# Altium schematic sheet TENG.SchDoc
size A4; SheetNumber: 3; SheetTotal: 5
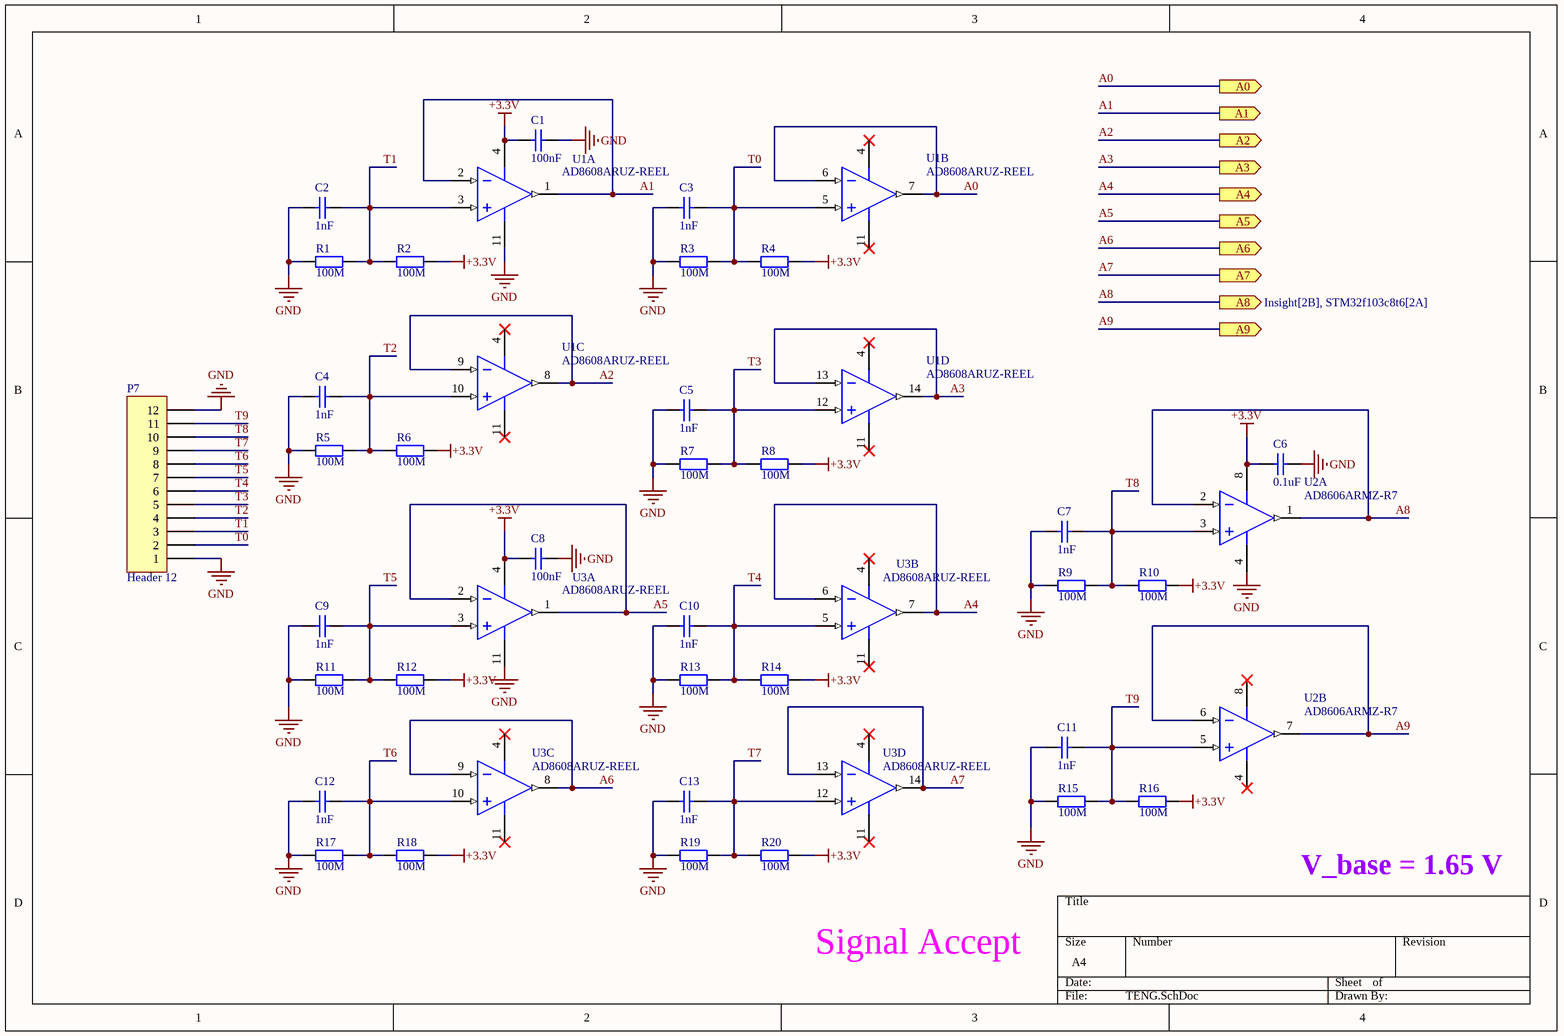
[diagram p0: TENG.SchDoc]

## Parts
C1  100nF  [0402_C]
C2  1nF  [0402_C]
C3  1nF  [0402_C]
C4  1nF  [0402_C]
C5  1nF  [0402_C]
C6  0.1uF  [0402_C]
C7  1nF  [0402_C]
C8  100nF  [0402_C]
C9  1nF  [0402_C]
C10  1nF  [0402_C]
C11  1nF  [0402_C]
C12  1nF  [0402_C]
C13  1nF  [0402_C]
P7  Header 12  [HDR1X12]
R1  100M  [0402_R]
R2  100M  [0402_R]
R3  100M  [0402_R]
R4  100M  [0402_R]
R5  100M  [0402_R]
R6  100M  [0402_R]
R7  100M  [0402_R]
R8  100M  [0402_R]
R9  100M  [0402_R]
R10  100M  [0402_R]
R11  100M  [0402_R]
R12  100M  [0402_R]
R13  100M  [0402_R]
R14  100M  [0402_R]
R15  100M  [0402_R]
R16  100M  [0402_R]
R17  100M  [0402_R]
R18  100M  [0402_R]
R19  100M  [0402_R]
R20  100M  [0402_R]
U1  AD8608ARUZ-REEL  [ADI-RU-14_N]  (parts A,B,C,D of 4)
U2  AD8606ARMZ-R7  [ADI-RM-8_N]  (parts A,B of 2)
U3  AD8608ARUZ-REEL  [ADI-RU-14_N]  (parts A,B,C,D of 4)

## Ports
A0 (out, see Insight[2A], STM32f103c8t6[1A]), A1 (out, see Insight[2B], STM32f103c8t6[1A]), A2 (out, see Insight[2B], STM32f103c8t6[1A]), A3 (out, see Insight[2B], STM32f103c8t6[1A]), A4 (out, see Insight[2B], STM32f103c8t6[1A]), A5 (out, see Insight[2B], STM32f103c8t6[1A]), A6 (out, see Insight[2B], STM32f103c8t6[1A]), A7 (out, see Insight[2B], STM32f103c8t6[1A]), A8 (out, see Insight[2B], STM32f103c8t6[2A]), A9 (out, see Insight[2B], STM32f103c8t6[2A])

## Nets
+3.3V: C1.2 C6.2 C8.2 R2.1 R4.1 R6.1 R8.1 R10.1 R12.1 R14.1 R16.1 R18.1 R20.1 U1.4(+V) U2.8(+V) U3.4(+V)
GND: C1.1 C2.2 C3.2 C4.2 C5.2 C6.1 C7.2 C8.1 C9.2 C10.2 C11.2 C12.2 C13.2 P7.1 P7.12 R1.2 R3.2 R5.2 R7.2 R9.2 R11.2 R13.2 R15.2 R17.2 R19.2 U1.11(-V) U2.4(-V) U3.11(-V)
A0: U1.6(-IN_B) U1.7(OUT_B) ; port A0
A1: U1.1(OUT_A) U1.2(-IN_A) ; port A1
A2: U1.8(OUT_C) U1.9(-IN_C) ; port A2
A3: U1.13(-IN_D) U1.14(OUT_D) ; port A3
A4: U3.6(-IN_B) U3.7(OUT_B) ; port A4
A5: U3.1(OUT_A) U3.2(-IN_A) ; port A5
A6: U3.8(OUT_C) U3.9(-IN_C) ; port A6
A7: U3.13(-IN_D) U3.14(OUT_D) ; port A7
A8: U2.1(OUT_A) U2.2(-IN_A) ; port A8
A9: U2.6(-IN_B) U2.7(OUT_B) ; port A9
T0: C3.1 P7.2 R3.1 R4.2 U1.5(+IN_B)
T1: C2.1 P7.3 R1.1 R2.2 U1.3(+IN_A)
T2: C4.1 P7.4 R5.1 R6.2 U1.10(+IN_C)
T3: C5.1 P7.5 R7.1 R8.2 U1.12(+IN_D)
T4: C10.1 P7.6 R13.1 R14.2 U3.5(+IN_B)
T5: C9.1 P7.7 R11.1 R12.2 U3.3(+IN_A)
T6: C12.1 P7.8 R17.1 R18.2 U3.10(+IN_C)
T7: C13.1 P7.9 R19.1 R20.2 U3.12(+IN_D)
T8: C7.1 P7.10 R9.1 R10.2 U2.3(+IN_A)
T9: C11.1 P7.11 R15.1 R16.2 U2.5(+IN_B)

## Notes on the sheet
- V_base = 1.65 V
- Signal Accept

## Library data of the parts
C1-C13 = Cap_0402: 0402贴片电容; Package: 0402; 常见贴片电容尺寸图: https://wenku.baidu.com/view/21d5206100f69e3143323968011ca300a6c3f6b2.html
P7 = Header 12: Header, 12-Pin; LatestRevisionDate: 17-Jul-2002; LatestRevisionNote: Re-released for DXP Platform.; Publisher: Altium Limited
R1-R20 = Res_0402: 贴片电阻; ComponentLink1Description: 供应商链接; ComponentLink1URL: http://www.szlcsc.com/product/details_17853.html; Package: 0402; Supplier: LC; SuppliersPartNumber: C17168
U1 U3 = AD8608-SMALL: Quad Channel Wide Bandwidth Operational Amplifier, 10 MHz BW, 5 V/us SR, Industrial, 14-pin SOP (RU-14), Reel; Generic Part Number: AD8608; Manufacturer: Analog Devices; Small Signal Bandwidth: 10MHz; V Span Min: 2.7V; Slew Rate: 5V/us; Iq/Amp: 1.2mA; Input Bias Current: 200fA; V Span Max: 6V; Amplifiers Per Package: 4; Input Offset Voltage: 20uV; RevisionNote: Reference Circuit URL fixed; PartNumber: AD8608ARUZ-REEL; ComponentLink4Description: Reference Circuit; DatasheetVersion: Rev. L; ComponentLink2Description: Datasheet; ComponentLink2URL: http://www.analog.com/static/imported-files/data_sheets/AD8605_8606_8608.pdf; ComponentLink1URL: http://www.analog.com/en/index.html; Code_JEDEC: MO-153AB-1; ComponentLink1Description: Manufacturer URL; ComponentLink3URL: http://www.analog.com/static/imported-files/packages/36057385283879153717235186773RU14.pdf; PackageReference: RU-14; ComponentLink4URL: http://www.analog.com/en/all-operational-amplifiers-op-amps/operational-amplifiers-op-amps/ad8608/products/product.html#product-recommendations; ComponentLink3Description: Package Specification; Mounting Technology: Surface Mount; PackageDescription: 14-Pin Thin Shrink Small Outline Package, Body 5 x 4.4 mm, Pitch 0.65 mm
U2 = AD8606: Double Channel Wide Bandwidth Operational Amplifier, 10 MHz BW, 5 V/us SR, Industrial, 8-pin SOP (RM-8), Reel; Manufacturer: Analog Devices; V Span Min: 2.7V; Iq/Amp: 1.2mA; Amplifiers Per Package: 2; Input Bias Current: 200fA; Input Offset Voltage: 20uV; V Span Max: 6V; Small Signal Bandwidth: 10MHz; Slew Rate: 5V/us; ComponentLink1Description: Manufacturer URL; ComponentLink4URL: http://www.analog.com/en/all-operational-amplifiers-op-amps/operational-amplifiers-op-amps/ad8606/products/product.html#product-recommendations; PartNumber: AD8606ARMZ-R7; Generic Part Number: AD8606; ComponentLink4Description: Reference Circuit; ComponentLink2Description: Datasheet; ComponentLink3Description: Package Specification; ComponentLink2URL: http://www.analog.com/static/imported-files/data_sheets/AD8605_8606_8608.pdf; Code_JEDEC: MO-187-AA; ComponentLink1URL: http://www.analog.com/en/index.html; DatasheetVersion: Rev. L; PackageDescription: 8-Pin Mini Small Outline Package, Body 3 x 3 mm, Pitch 0.65 mm; RevisionNote: Reference Circuit URL fixed; Mounting Technology: Surface Mount; PackageReference: RM-8; ComponentLink3URL: http://www.analog.com/static/imported-files/packages/PKG_PDF/MSOP%28RM%29/RM_8.pdf